# EAGLE schematic Power_Sensor_v65 (EAGLE 9.7.0)
AUTHOR: Gabriel Marcano; REV: A; TITLE: Soil Power Sensor
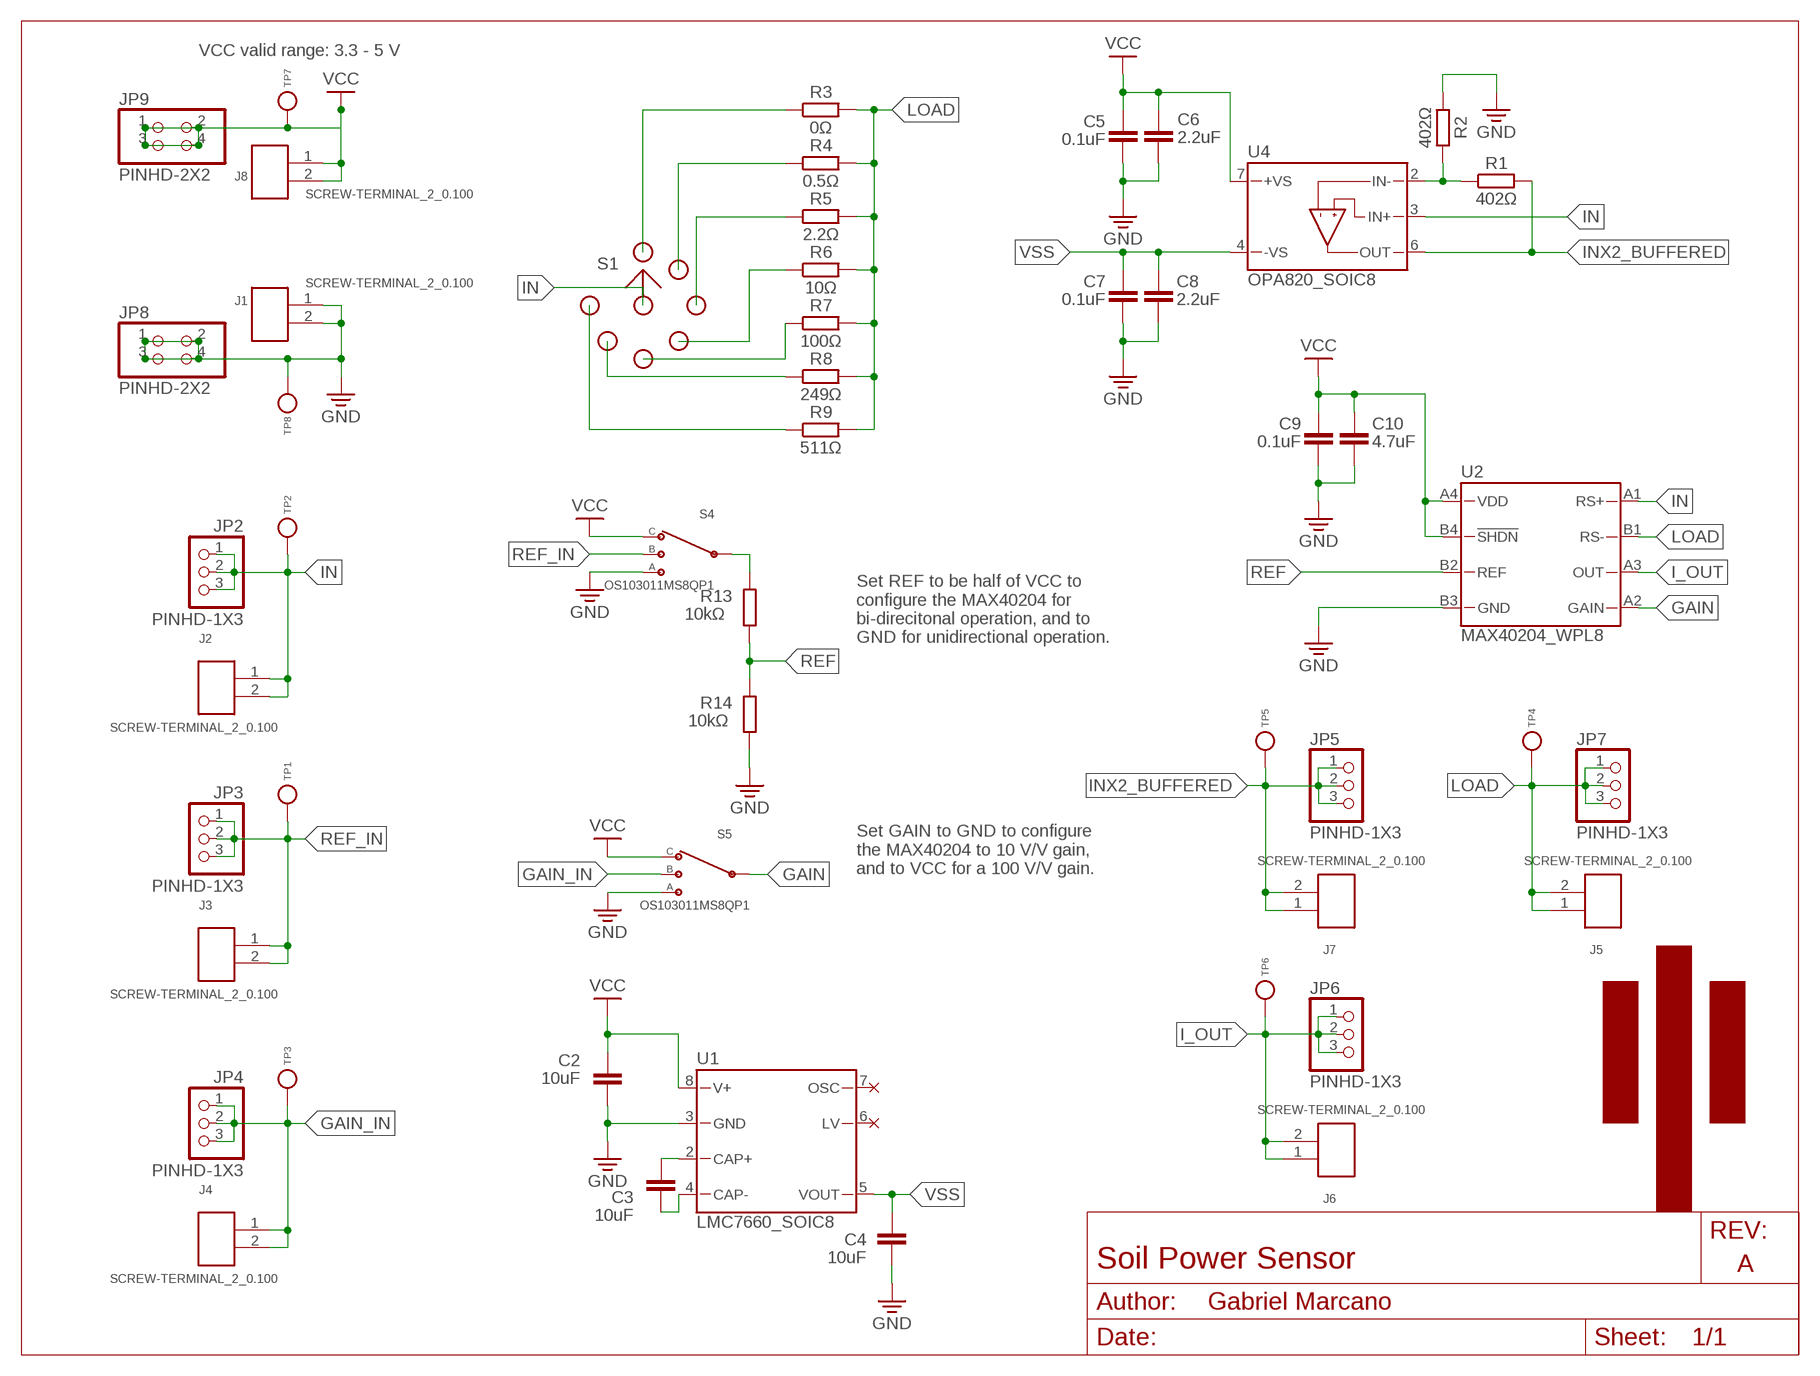
[diagram p0: schematic, sheet 1]

## Parts
C2  10uF  C_CHIP-0402(1005-METRIC)  [CAPC1005X60]
C3  10uF  C_CHIP-0402(1005-METRIC)  [CAPC1005X60]
C4  10uF  C_CHIP-0402(1005-METRIC)  [CAPC1005X60]
C5  0.1uF  C_CHIP-0402(1005-METRIC)  [CAPC1005X60]
C6  2.2uF  C_CHIP-0402(1005-METRIC)  [CAPC1005X60]
C7  0.1uF  C_CHIP-0402(1005-METRIC)  [CAPC1005X60]
C8  2.2uF  C_CHIP-0402(1005-METRIC)  [CAPC1005X60]
C9  0.1uF  C_CHIP-0402(1005-METRIC)  [CAPC1005X60]
C10  4.7uF  C_CHIP-0402(1005-METRIC)  [CAPC1005X60]
J1  SCREW-TERMINAL_2_0.100  [CONN_BLOCK_2]
J2  SCREW-TERMINAL_2_0.100  [CONN_BLOCK_2]
J3  SCREW-TERMINAL_2_0.100  [CONN_BLOCK_2]
J4  SCREW-TERMINAL_2_0.100  [CONN_BLOCK_2]
J5  SCREW-TERMINAL_2_0.100  [CONN_BLOCK_2]
J6  SCREW-TERMINAL_2_0.100  [CONN_BLOCK_2]
J7  SCREW-TERMINAL_2_0.100  [CONN_BLOCK_2]
J8  SCREW-TERMINAL_2_0.100  [CONN_BLOCK_2]
JP2  PINHD-1X3  [1X03]
JP3  PINHD-1X3  [1X03]
JP4  PINHD-1X3  [1X03]
JP5  PINHD-1X3  [1X03]
JP6  PINHD-1X3  [1X03]
JP7  PINHD-1X3  [1X03]
JP8  PINHD-2X2  [2X02]
JP9  PINHD-2X2  [2X02]
R1  402Ω  R_CHIP-0402(1005-METRIC)  [RESC1005X40]
R2  402Ω  R_CHIP-0402(1005-METRIC)  [RESC1005X40]
R3  0Ω  R_CHIP-1206(3216-METRIC)  [RESC3216X70]
R4  0.5Ω  R_CHIP-1206(3216-METRIC)  [RESC3216X70]
R5  2.2Ω  R_CHIP-1206(3216-METRIC)  [RESC3216X70]
R6  10Ω  R_CHIP-1206(3216-METRIC)  [RESC3216X70]
R7  100Ω  R_CHIP-1206(3216-METRIC)  [RESC3216X70]
R8  249Ω  R_CHIP-1206(3216-METRIC)  [RESC3216X70]
R9  511Ω  R_CHIP-1206(3216-METRIC)  [RESC3216X70]
R13  10kΩ  R_CHIP-1206(3216-METRIC)  [RESC3216X70]
R14  10kΩ  R_CHIP-1206(3216-METRIC)  [RESC3216X70]
S1  RM100772BCB  [RMXXX77]
S4  OS103011MS8QP1  [OS102011MS8QP1]
S5  OS103011MS8QP1  [OS102011MS8QP1]
TP1  TEST_POINT_0.040IN  [TESTPOINT_0.040IN]
TP2  TEST_POINT_0.040IN  [TESTPOINT_0.040IN]
TP3  TEST_POINT_0.040IN  [TESTPOINT_0.040IN]
TP4  TEST_POINT_0.040IN  [TESTPOINT_0.040IN]
TP5  TEST_POINT_0.040IN  [TESTPOINT_0.040IN]
TP6  TEST_POINT_0.040IN  [TESTPOINT_0.040IN]
TP7  TEST_POINT_0.040IN  [TESTPOINT_0.040IN]
TP8  TEST_POINT_0.040IN  [TESTPOINT_0.040IN]
U1  LMC7660_SOIC8  [SOIC127P599X175-8]
U2  MAX40204_WPL8  [BGA8C34P4X2_84X146X50]
U4  OPA820_SOIC8  [SOIC127P599X175-8]
U$1  UCSD_TRIDENT_SOLID_250MIL  [UCSD_TRIDENT_SOLID_250MIL]
U$4  NC  (no package)
U$5  NC  (no package)

## Nets
GAIN: S5.2(C) U2.A2(GAIN)
GAIN_IN: J4.1 J4.2 JP4.1 JP4.2 JP4.3 S5.3 TP3.TESTPOINT
GND: C2.2 C4.1 C5.1 C6.1 C7.1 C8.1 C9.2 C10.2 J1.1 J1.2 JP8.1 JP8.2 JP8.3 JP8.4 R2.1 R14.1 S4.1 S5.1 TP8.TESTPOINT U1.3(GND) U2.B3(GND)
I_OUT: J6.1 J6.2 JP6.1 JP6.2 JP6.3 TP6.TESTPOINT U2.A3(OUT)
IN: J2.1 J2.2 JP2.1 JP2.2 JP2.3 S1.P$1 TP2.TESTPOINT U2.A1(RS+) U4.3(IN+)
INX2_BUFFERED: J7.1 J7.2 JP5.1 JP5.2 JP5.3 R1.2 TP5.TESTPOINT U4.6(OUT)
LOAD: J5.1 J5.2 JP7.1 JP7.2 JP7.3 R3.2 R4.2 R5.2 R6.2 R7.2 R8.2 R9.2 TP4.TESTPOINT U2.B1(RS-)
N$1: C3.1 U1.2(CAP+)
N$2: C3.2 U1.4(CAP-)
N$3: R3.1 S1.P$2
N$4: R1.1 R2.2 U4.2(IN-)
N$5: R4.1 S1.P$3
N$6: R5.1 S1.P$4
N$7: R6.1 S1.P$5
N$8: R7.1 S1.P$6
N$9: U1.6(LV) U$5.NC$1
N$10: R9.1 S1.P$8
N$11: R8.1 S1.P$7
N$12: U1.7(OSC) U$4.NC$1
N$17: R13.2 S4.2(C)
REF: R13.1 R14.2 U2.B2(REF)
REF_IN: J3.1 J3.2 JP3.1 JP3.2 JP3.3 S4.3 TP1.TESTPOINT
VCC: C2.1 C5.2 C6.2 C9.1 C10.1 J8.1 J8.2 JP9.1 JP9.2 JP9.3 JP9.4 S4.4 S5.4 TP7.TESTPOINT U1.8(V+) U2.A4(VDD) U2.B4(!SHDN) U4.7(+VS)
VSS: C4.2 C7.2 C8.2 U1.5(VOUT) U4.4(-VS)

## Notes on the sheet
- VCC valid range: 3.3 - 5 V
- Set REF to be half of VCC to
  configure the MAX40204 for
  bi-direcitonal operation, and to
  GND for unidirectional operation.
- Set GAIN to GND to configure
  the MAX40204 to 10 V/V gain,
  and to VCC for a 100 V/V gain.

## Library data of the parts
C2-C4 = Capacitor:C: Capacitor - Generic; CATEGORY: Capacitor; DIGIKEY: 1276-1450-1-ND
C5 C7 C9 = Capacitor:C: Capacitor - Generic; CATEGORY: Capacitor; DIGIKEY: 1276-6720-1-ND
C6 C8 = Capacitor:C: Capacitor - Generic; CATEGORY: Capacitor; DIGIKEY: 1276-1469-1-ND
C10 = Capacitor:C: Capacitor - Generic; CATEGORY: Capacitor; DIGIKEY: 1276-1482-1-ND
J1-J8 = headers:SCREW-TERMINAL_2_0.100: 2x 0.100 in screw terminal block; DIGIKEY: 277-1273-ND; MOUSER: 651-1725656; NEWARK: 71C4107
JP2-JP7 = Connector:PINHD-1X3: PIN HEADER; CATEGORY: CONNECTOR; DIGIKEY: 78511-403HLF-ND; SUB-CATEGORY: PIN-HEADER
JP8 JP9 = Connector:PINHD-2X2: PIN HEADER; CATEGORY: CONNECTOR; DIGIKEY: S2012EC-01-ND; SUB-CATEGORY: PIN-HEADER
R1 R2 = Resistor:R: Resistor Fixed - Generic; CATEGORY: Resistor; DIGIKEY: 2571-RM04F4020CTTR-ND; SUB-CATEGORY: Fixed; TOLERANCE: 1%
R3 = Resistor:R: Resistor Fixed - Generic; CATEGORY: Resistor; DIGIKEY: 2679-HPCR1206-V-000TTR-ND; SUB-CATEGORY: Fixed; TOLERANCE: 1%
R4 = Resistor:R: Resistor Fixed - Generic; CATEGORY: Resistor; DIGIKEY: CSR1206FKR500CT-ND; SUB-CATEGORY: Fixed; TOLERANCE: 1%
R5 = Resistor:R: Resistor Fixed - Generic; CATEGORY: Resistor; DIGIKEY: 2997-CR082R20FTR-ND; SUB-CATEGORY: Fixed; TOLERANCE: 1%
R6 = Resistor:R: Resistor Fixed - Generic; CATEGORY: Resistor; DIGIKEY: 2997-CR0810R0FTR-ND; SUB-CATEGORY: Fixed; TOLERANCE: 1%
R7 = Resistor:R: Resistor Fixed - Generic; CATEGORY: Resistor; DIGIKEY: 2997-CR081000FTR-ND; SUB-CATEGORY: Fixed; TOLERANCE: 1%
R8 = Resistor:R: Resistor Fixed - Generic; CATEGORY: Resistor; DIGIKEY: 2571-RM12F2490CTTR-ND; SUB-CATEGORY: Fixed; TOLERANCE: 1%
R9 = Resistor:R: Resistor Fixed - Generic; CATEGORY: Resistor; DIGIKEY: 2997-CR085110FTR-ND; SUB-CATEGORY: Fixed; TOLERANCE: 1%
R13 R14 = Resistor:R: Resistor Fixed - Generic; CATEGORY: Resistor; DIGIKEY: 2997-CR081002FTR-ND; SUB-CATEGORY: Fixed
S1 = Soil:RM100772BCB; DATASHEET: https://www.ckswitches.com/media/1910/rm.pdf; DESCRIPTION: Rotary Switch 8 Position SP7T 500mA (DC) AC Through Hole; DIGIKEY: CKN10691-ND; MANUFACTURER: C&K; MOUSER: 611-RM100772BCB; MPN: RM100772BCB
S4 S5 = switches:OS103011MS8QP1: Slide Switch SP3T Through Hole; DIGIKEY: CKN9543-ND
TP1-TP8 = headers:TEST_POINT_0.040IN: 0.040in Test Point; DIGIKEY: 5001K-ND
U1 = Soil:LMC7660_SOIC8: LMC7660 Switched Capacitor Voltage Converter Product information: LMC7660 <https://www.ti.com/product/LMC7660> Package: SOIC (D) 8 pin; DATASHEET: https://www.ti.com/lit/gpn/lmc7660; DESCRIPTION: Charge Pump Switching Regulator IC Negative Fixed -Vin 1 Output - 8-SOIC (0.154", 3.90mm Width); DIGIKEY: 2156-LMC7660IM-ND; MANUFACTURER: Texas Instruments; MPN: LMC7660IM/NOPB
U2 = Soil:MAX40204_WPL8; DATASHEET: https://datasheets.maximintegrated.com/en/ds/MAX40204.pdf; DESCRIPTION: Current Sense Amplifier 1 Circuit - 8-WLP (1.47x0.85); DIGIKEY: 175-MAX40204ANA+-ND; MANUFACTURER: Maxim Integrated; MOUSER: 700-MAX40204ANA+; MPN: MAX40204ANA+
U4 = Soil:OPA820_SOIC8; DATASHEET: https://www.ti.com/general/docs/suppproductinfo.tsp?distId=10&gotoUrl=https%3A%2F%2Fwww.ti.com%2Flit%2Fgpn%2Fopa820; DESCRIPTION: Voltage Feedback Amplifier 1 Circuit - 8-SOIC; DIGIKEY: 296-48640-1-ND; MANUFACTURER: Texas Instruments; MOUSER: 595-OPA820ID; MPN: OPA820ID
U$1 = logos:UCSD_TRIDENT_SOLID
U$4 U$5 = Soil:NC